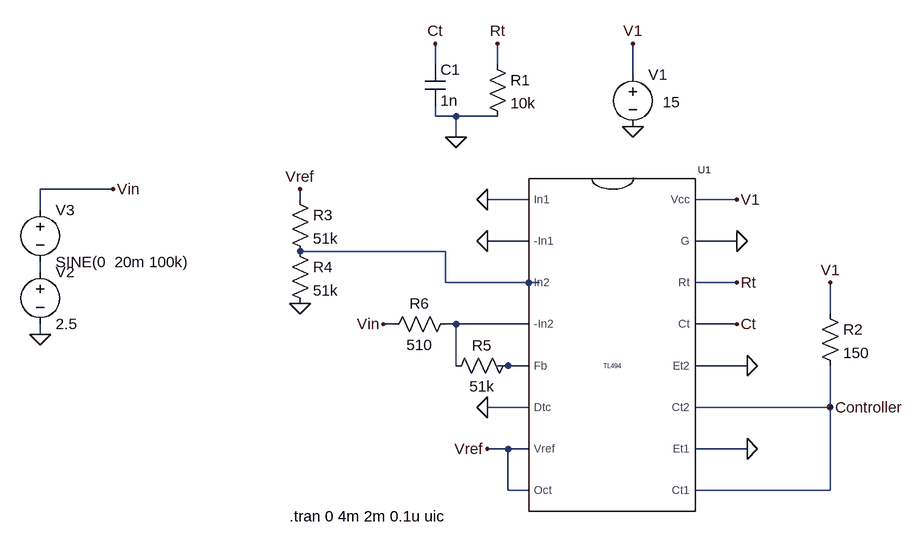
[diagram p0: schematic Banco de prueba controlador.asc]
Banco de prueba controlador.asc, the LTspice schematic file:
Version 4
SHEET 1 980 680
WIRE 0 -176 0 -208
WIRE 96 -176 96 -208
WIRE 304 -160 304 -208
WIRE 0 -96 0 -112
WIRE 32 -96 0 -96
WIRE 96 -96 32 -96
WIRE 32 -64 32 -96
WIRE -496 16 -608 16
WIRE -208 32 -208 16
WIRE 144 32 80 32
WIRE 464 32 400 32
WIRE -608 48 -608 16
WIRE 144 96 80 96
WIRE 464 96 400 96
WIRE 16 112 -208 112
WIRE -608 144 -608 128
WIRE 16 160 16 112
WIRE 144 160 16 160
WIRE 160 160 144 160
WIRE 464 160 400 160
WIRE 608 208 608 160
WIRE -64 224 -80 224
WIRE 32 224 16 224
WIRE 144 224 32 224
WIRE 464 224 400 224
WIRE -608 240 -608 224
WIRE 32 288 32 224
WIRE 112 288 96 288
WIRE 144 288 112 288
WIRE 480 288 400 288
WIRE 144 352 80 352
WIRE 608 352 608 288
WIRE 608 352 400 352
WIRE 112 416 80 416
WIRE 144 416 112 416
WIRE 480 416 400 416
WIRE 112 480 112 416
WIRE 144 480 112 480
WIRE 608 480 608 352
WIRE 608 480 400 480
FLAG 464 32 V1
FLAG 464 96 0
FLAG 32 -64 0
FLAG 464 160 Rt
FLAG 96 -208 Rt
FLAG 0 -208 Ct
FLAG 464 224 Ct
FLAG 80 32 0
FLAG 80 96 0
FLAG 80 352 0
FLAG 480 288 0
FLAG 480 416 0
FLAG 80 416 Vref
FLAG 608 352 Controller
FLAG 608 160 V1
FLAG -208 16 Vref
FLAG -80 224 Vin
FLAG -208 192 0
FLAG 304 -80 0
FLAG 304 -208 V1
FLAG -608 240 0
FLAG -496 16 Vin
SYMBOL tl494 272 288 R0
SYMATTR InstName U1
SYMBOL cap -16 -176 R0
SYMATTR InstName C1
SYMATTR Value 1n
SYMBOL res 80 -192 R0
SYMATTR InstName R1
SYMATTR Value 10k
SYMBOL res 592 192 R0
SYMATTR InstName R2
SYMATTR Value 150
SYMBOL res -224 16 R0
SYMATTR InstName R3
SYMATTR Value 51k
SYMBOL res -224 96 R0
SYMATTR InstName R4
SYMATTR Value 51k
SYMBOL res 128 272 R90
WINDOW 0 0 56 VBottom 2
WINDOW 3 32 56 VTop 2
SYMATTR InstName R5
SYMATTR Value 51k
SYMBOL res 32 208 R90
WINDOW 0 0 56 VBottom 2
WINDOW 3 32 56 VTop 2
SYMATTR InstName R6
SYMATTR Value 510
SYMBOL voltage 304 -176 R0
WINDOW 3 46 58 Left 2
WINDOW 123 0 0 Left 0
WINDOW 39 0 0 Left 0
SYMATTR Value 15
SYMATTR InstName V1
SYMBOL voltage -608 128 R0
WINDOW 123 0 0 Left 0
WINDOW 39 0 0 Left 0
SYMATTR InstName V2
SYMATTR Value 2.5
SYMBOL voltage -608 32 R0
WINDOW 123 0 0 Left 0
WINDOW 39 0 0 Left 0
SYMATTR InstName V3
SYMATTR Value SINE(0  20m 100k)
TEXT -224 520 Left 2 !.tran 0 4m 2m 0.1u uic

The netlist it stands for:
* Banco de prueba controlador.asc
XU1 0 0 N001 N003 N004 0 Vref Vref Controller 0 Controller 0 Ct Rt 0 V1 TL494 TL494  ; pins In1 -In1 In2 -In2 Fb Dtc Vref Oct Ct1 Et1 Ct2 Et2 Ct Rt G Vcc
C1 Ct 0 1n
R1 Rt 0 10k
R2 V1 Controller 150
R3 Vref N001 51k
R4 N001 0 51k
R5 N004 N003 51k
R6 N003 Vin 510
V1 V1 0 15
V2 N002 0 2.5
V3 Vin N002 SINE(0  20m 100k)
.tran 0 4m 2m 0.1u uic
.lib tl494.sub
.backanno
.end